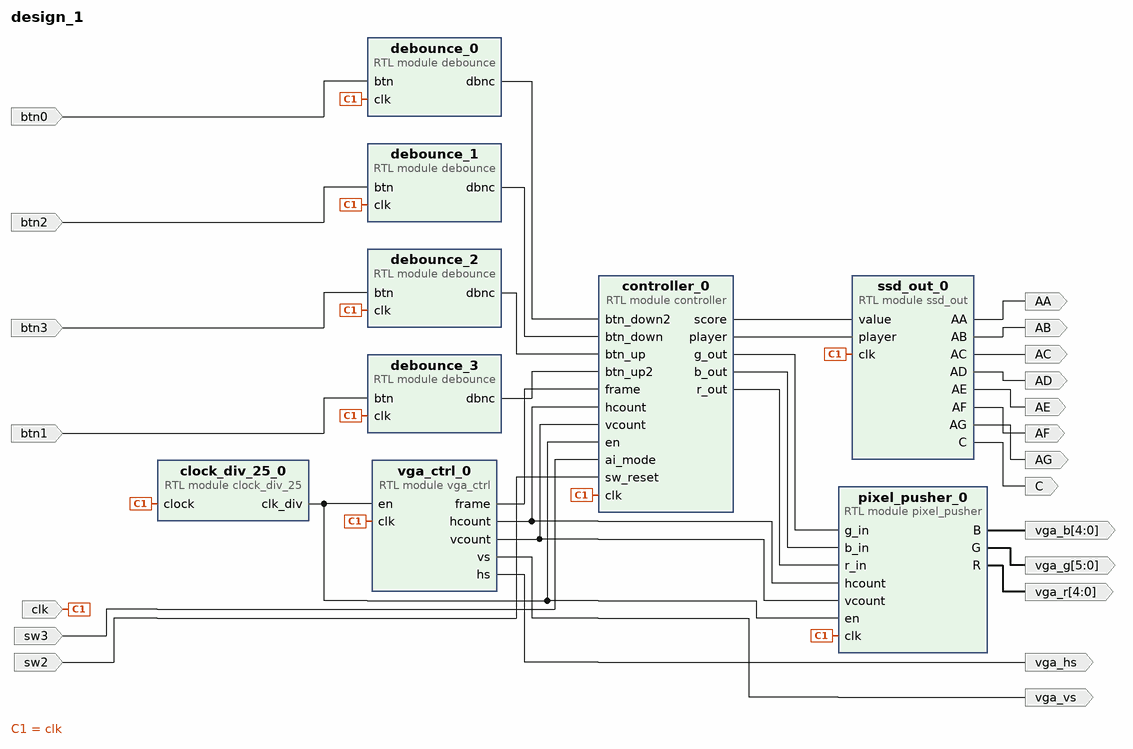
[diagram p0: block diagram of the top level]
# Vivado block design design_1, xc7z010clg400-1, Vivado 2018.2
create_bd_design design_1

create_bd_port -dir I -type clk clk
create_bd_port -dir O vga_vs
create_bd_port -dir O vga_hs
create_bd_port -dir O -from 4 -to 0 vga_r
create_bd_port -dir O -from 4 -to 0 vga_b
create_bd_port -dir O -from 5 -to 0 vga_g
create_bd_port -dir I -type rst btn0
create_bd_port -dir I btn3
create_bd_port -dir I btn2
create_bd_port -dir I btn1
create_bd_port -dir O AA
create_bd_port -dir O AB
create_bd_port -dir O AC
create_bd_port -dir O AD
create_bd_port -dir O AE
create_bd_port -dir O AF
create_bd_port -dir O AG
create_bd_port -dir O C
create_bd_port -dir I sw3
create_bd_port -dir I -type rst sw2

create_bd_cell -type module -reference clock_div_25 clock_div_25_0
create_bd_cell -type module -reference pixel_pusher pixel_pusher_0
create_bd_cell -type module -reference vga_ctrl vga_ctrl_0
create_bd_cell -type module -reference debounce debounce_0
create_bd_cell -type module -reference debounce debounce_1
create_bd_cell -type module -reference debounce debounce_2
create_bd_cell -type module -reference debounce debounce_3
create_bd_cell -type module -reference ssd_out ssd_out_0
create_bd_cell -type module -reference controller controller_0

# ---- connections ----

connect_bd_net [get_bd_pins vga_ctrl_0/hcount] [get_bd_pins pixel_pusher_0/hcount] [get_bd_pins controller_0/hcount]
connect_bd_net [get_bd_pins vga_ctrl_0/vcount] [get_bd_pins pixel_pusher_0/vcount] [get_bd_pins controller_0/vcount]
connect_bd_net -net clk_0_1 [get_bd_ports clk] \
  [get_bd_pins clock_div_25_0/clock] [get_bd_pins pixel_pusher_0/clk] [get_bd_pins vga_ctrl_0/clk] \
  [get_bd_pins debounce_2/clk] [get_bd_pins debounce_1/clk] [get_bd_pins debounce_0/clk] [get_bd_pins debounce_3/clk] \
  [get_bd_pins ssd_out_0/clk] [get_bd_pins controller_0/clk]
connect_bd_net [get_bd_pins vga_ctrl_0/vs] [get_bd_ports vga_vs]
connect_bd_net [get_bd_pins vga_ctrl_0/hs] [get_bd_ports vga_hs]
connect_bd_net [get_bd_pins pixel_pusher_0/R] [get_bd_ports vga_r]
connect_bd_net [get_bd_pins pixel_pusher_0/B] [get_bd_ports vga_b]
connect_bd_net [get_bd_pins pixel_pusher_0/G] [get_bd_ports vga_g]
connect_bd_net [get_bd_pins controller_0/g_out] [get_bd_pins pixel_pusher_0/g_in]
connect_bd_net [get_bd_pins controller_0/b_out] [get_bd_pins pixel_pusher_0/b_in]
connect_bd_net [get_bd_pins controller_0/r_out] [get_bd_pins pixel_pusher_0/r_in]
connect_bd_net [get_bd_pins vga_ctrl_0/frame] [get_bd_pins controller_0/frame]
connect_bd_net [get_bd_pins clock_div_25_0/clk_div] [get_bd_pins vga_ctrl_0/en] [get_bd_pins pixel_pusher_0/en] [get_bd_pins controller_0/en]
connect_bd_net -net btn0_1 [get_bd_ports btn0] [get_bd_pins debounce_0/btn]
connect_bd_net [get_bd_pins debounce_1/dbnc] [get_bd_pins controller_0/btn_down]
connect_bd_net [get_bd_pins debounce_2/dbnc] [get_bd_pins controller_0/btn_up]
connect_bd_net -net btn3_1 [get_bd_ports btn3] [get_bd_pins debounce_2/btn]
connect_bd_net -net btn2_1 [get_bd_ports btn2] [get_bd_pins debounce_1/btn]
connect_bd_net [get_bd_pins debounce_0/dbnc] [get_bd_pins controller_0/btn_down2]
connect_bd_net -net btn_0_1 [get_bd_ports btn1] [get_bd_pins debounce_3/btn]
connect_bd_net [get_bd_pins debounce_3/dbnc] [get_bd_pins controller_0/btn_up2]
connect_bd_net [get_bd_pins ssd_out_0/AA] [get_bd_ports AA]
connect_bd_net [get_bd_pins ssd_out_0/AB] [get_bd_ports AB]
connect_bd_net [get_bd_pins ssd_out_0/AC] [get_bd_ports AC]
connect_bd_net [get_bd_pins ssd_out_0/AD] [get_bd_ports AD]
connect_bd_net [get_bd_pins ssd_out_0/AE] [get_bd_ports AE]
connect_bd_net [get_bd_pins ssd_out_0/AF] [get_bd_ports AF]
connect_bd_net [get_bd_pins ssd_out_0/AG] [get_bd_ports AG]
connect_bd_net [get_bd_pins ssd_out_0/C] [get_bd_ports C]
connect_bd_net -net ai_mode_0_1 [get_bd_ports sw3] [get_bd_pins controller_0/ai_mode]
connect_bd_net [get_bd_pins controller_0/score] [get_bd_pins ssd_out_0/value]
connect_bd_net [get_bd_pins controller_0/player] [get_bd_pins ssd_out_0/player]
connect_bd_net -net sw_reset_0_1 [get_bd_ports sw2] [get_bd_pins controller_0/sw_reset]

validate_bd_design
save_bd_design
